# Altium schematic sheet POWER.SchDoc
size A4
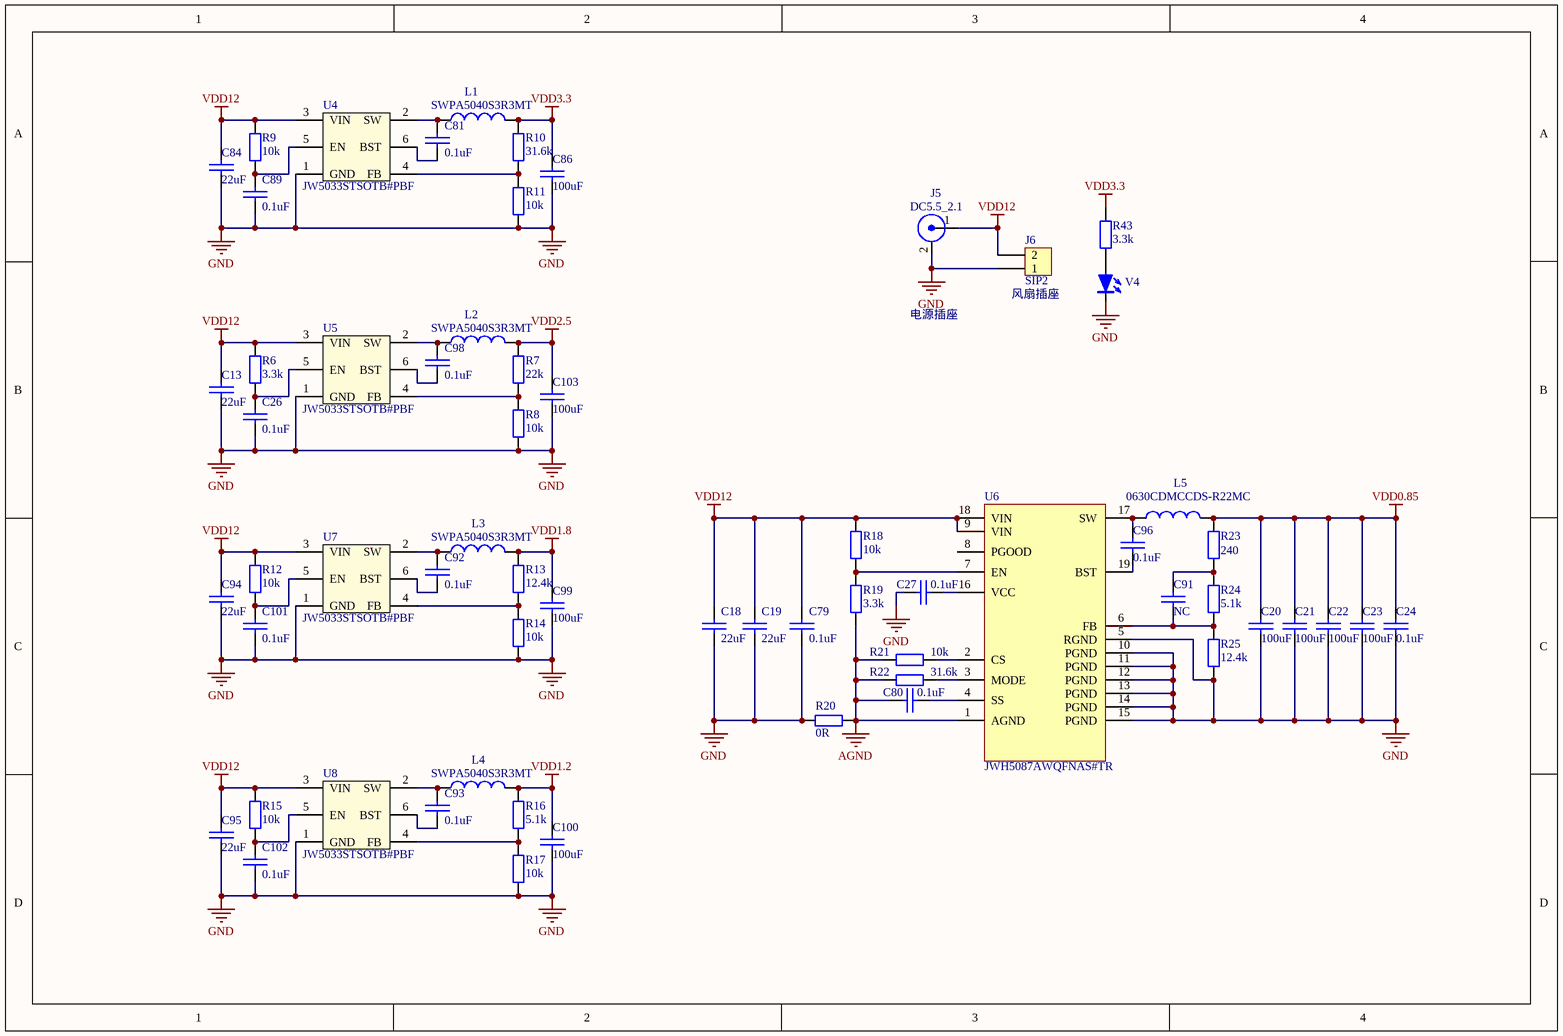
[diagram p0: POWER.SchDoc]

## Parts
C13  22uF  [1210_C_M]
C18  22uF  [1210_C_M]
C19  22uF  [1210_C_M]
C20  100uF  [1210_C_M]
C21  100uF  [1210_C_M]
C22  100uF  [1210_C_M]
C23  100uF  [1210_C_M]
C24  0.1uF  [0402_C_M]
C26  0.1uF  [0402_C_M]
C27  0.1uF  [0402_C_M]
C79  0.1uF  [0402_C_M]
C80  0.1uF  [0402_C_M]
C81  0.1uF  [0402_C_M]
C84  22uF  [1210_C_M]
C86  100uF  [1210_C_M]
C89  0.1uF  [0402_C_M]
C91  NC  [0402_C_M]
C92  0.1uF  [0402_C_M]
C93  0.1uF  [0402_C_M]
C94  22uF  [1210_C_M]
C95  22uF  [1210_C_M]
C96  0.1uF  [0402_C_M]
C98  0.1uF  [0402_C_M]
C99  100uF  [1210_C_M]
C100  100uF  [1210_C_M]
C101  0.1uF  [0402_C_M]
C102  0.1uF  [0402_C_M]
C103  100uF  [1210_C_M]
J5  DC5.5_2.1  [DC5.5]
J6  SIP2  [2.54mm_2p]
L1  SWPA5040S3R3MT  [CD42]
L2  SWPA5040S3R3MT  [CD42]
L3  SWPA5040S3R3MT  [CD42]
L4  SWPA5040S3R3MT  [CD42]
L5  0630CDMCCDS-R22MC  [SWPA8050S]
R6  3.3k  [0402_R_M]
R7  22k  [0402_R_M]
R8  10k  [0402_R_M]
R9  10k  [0402_R_M]
R10  31.6k  [0402_R_M]
R11  10k  [0402_R_M]
R12  10k  [0402_R_M]
R13  12.4k  [0402_R_M]
R14  10k  [0402_R_M]
R15  10k  [0402_R_M]
R16  5.1k  [0402_R_M]
R17  10k  [0402_R_M]
R18  10k  [0402_R_M]
R19  3.3k  [0402_R_M]
R20  0R  [0402_R_M]
R21  10k  [0402_R_M]
R22  31.6k  [0402_R_M]
R23  240  [0402_R_M]
R24  5.1k  [0402_R_M]
R25  12.4k  [0402_R_M]
R43  3.3k  [0402_R_M]
U4  JW5033STSOTB#PBF  [SOT23-6]
U5  JW5033STSOTB#PBF  [SOT23-6]
U6  JWH5087AWQFNAS#TR
U7  JW5033STSOTB#PBF  [SOT23-6]
U8  JW5033STSOTB#PBF  [SOT23-6]
V4  LED  [0805D]  (value not drawn)

## Nets
AGND: C80.1 R19.1 R20.2 R21.2 R22.2 U6.1(AGND)
GND: C13.2 C18.1 C19.1 C20.2 C21.2 C22.2 C23.2 C24.1 C26.2 C27.2 C79.2 C84.2 C86.2 C89.2 C94.2 C95.2 C99.2 C100.2 C101.2 C102.2 C103.2 J5.2 J6.1 R8.2 R11.2 R14.2 R17.2 R20.1 R25.2 U4.1(GND) U5.1(GND) U6.5(RGND) U6.10(PGND) U6.11(PGND) U6.12(PGND) U6.13(PGND) U6.14(PGND) U6.15(PGND) U7.1(GND) U8.1(GND) V4.2
VDD0.85: C20.1 C21.1 C22.1 C23.1 C24.2 L5.2 R23.1
VDD1.2: C100.1 L4.2 R16.2
VDD1.8: C99.1 L3.2 R13.2
VDD2.5: C103.1 L2.2 R7.2
VDD3.3: C86.1 L1.2 R10.2 R43.2
VDD12: C13.1 C18.2 C19.2 C79.1 C84.1 C94.1 C95.1 J5.1 J6.2 R6.2 R9.2 R12.2 R15.2 R18.1 U4.3(VIN) U5.3(VIN) U6.9(VIN) U6.18(VIN) U7.3(VIN) U8.3(VIN)
NetC26_1: C26.1 R6.1 U5.5(EN)
NetC27_1: C27.1 U6.16(VCC)
NetC80_2: C80.2 U6.4(SS)
NetC81_1: C81.1 U4.6(BST)
NetC81_2: C81.2 L1.1 U4.2(SW)
NetC89_1: C89.1 R9.1 U4.5(EN)
NetC91_1: C91.1 R24.2 R25.1 U6.6(FB)
NetC91_2: C91.2 R23.2 R24.1
NetC92_1: C92.1 U7.6(BST)
NetC92_2: C92.2 L3.1 U7.2(SW)
NetC93_1: C93.1 U8.6(BST)
NetC93_2: C93.2 L4.1 U8.2(SW)
NetC96_1: C96.1 U6.19(BST)
NetC96_2: C96.2 L5.1 U6.17(SW)
NetC98_1: C98.1 U5.6(BST)
NetC98_2: C98.2 L2.1 U5.2(SW)
NetC101_1: C101.1 R12.1 U7.5(EN)
NetC102_1: C102.1 R15.1 U8.5(EN)
NetR7_1: R7.1 R8.1 U5.4(FB)
NetR10_1: R10.1 R11.1 U4.4(FB)
NetR13_1: R13.1 R14.1 U7.4(FB)
NetR16_1: R16.1 R17.1 U8.4(FB)
NetR18_2: R18.2 R19.2 U6.7(EN)
NetR21_1: R21.1 U6.2(CS)
NetR22_1: R22.1 U6.3(MODE)
NetR43_1: R43.1 V4.1

Not connected (* = marked no-connect by the designer): U6 8(PGOOD)

## Notes on the sheet
- (near J6) 风扇插座
- 电源插座

## Library data of the parts
C13 C18-C24 C26 C27 C79-C81 C84 C86 C89 C91-C96 C98-C103 = CAP
J5 = BNC
L1-L5 = INDUCTOR1
R6-R25 R43 = RES2
U4 U5 U7 U8 = JW5060TTSOTB#PBF
U6 = IC_JW85012
V4 = LED2